# Altium schematic sheet Schematic_STM32.SchDoc
size A4; SheetNumber: 1; SheetTotal: 8
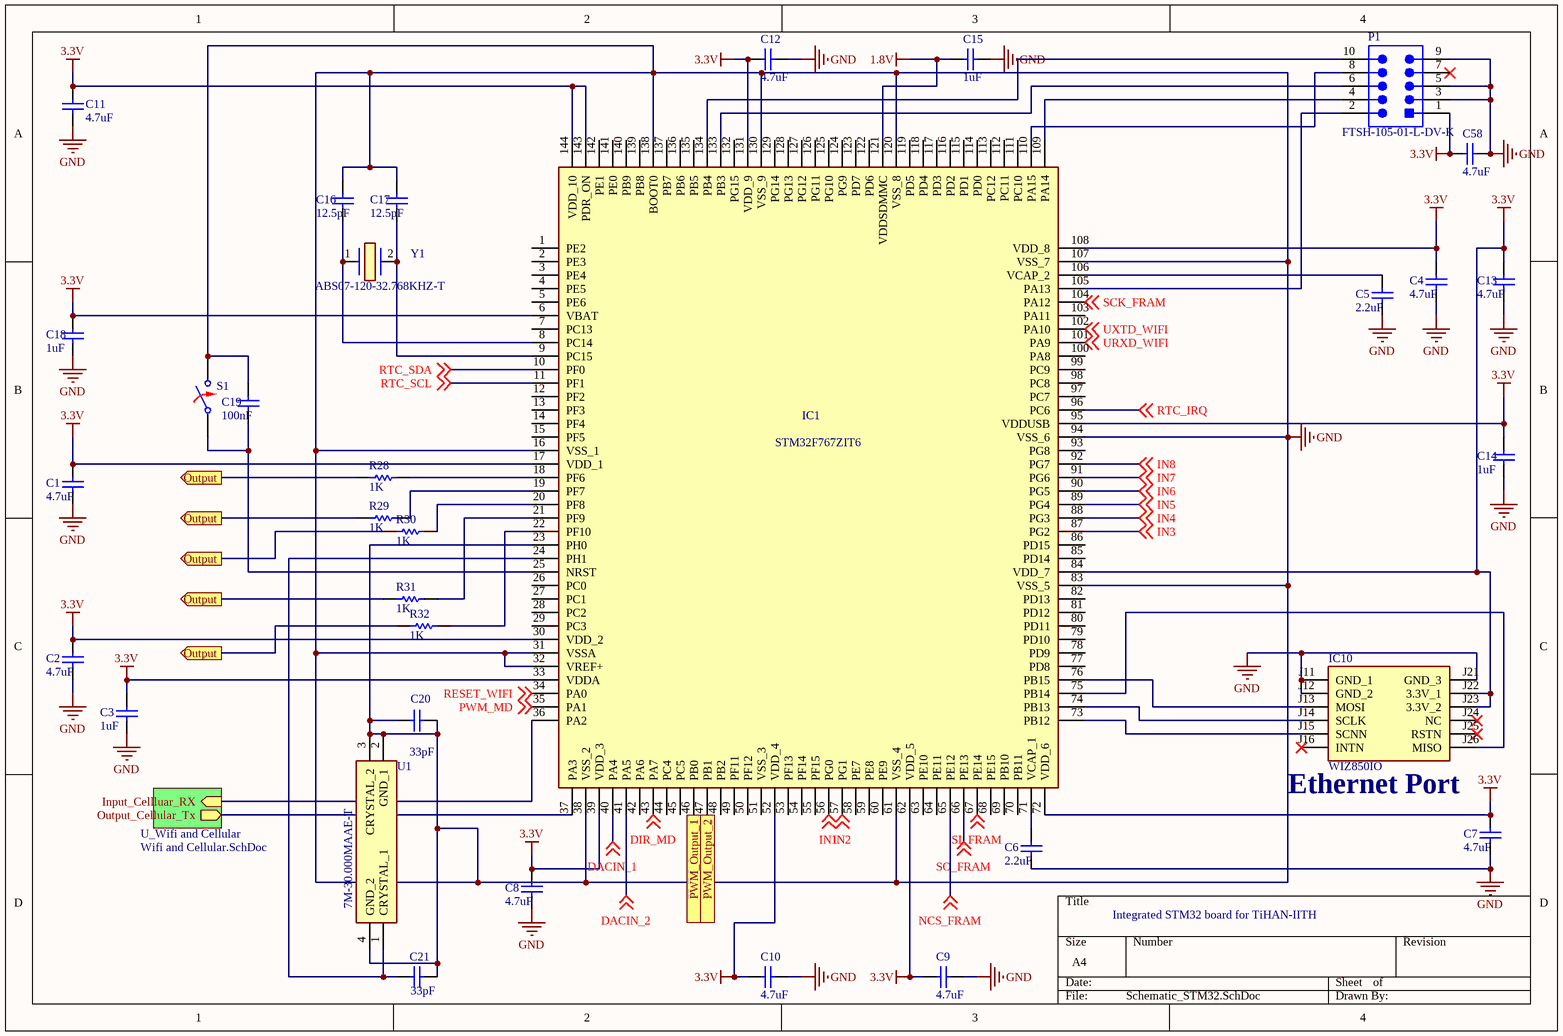
[diagram p0: Schematic_STM32.SchDoc]

## Parts
C1  value 4.7uF  [C1206]  (hidden comment: Cap)
C2  value 4.7uF  [C1206]  (hidden comment: Cap)
C3  value 1uF  [C1206]  (hidden comment: Cap)
C4  value 4.7uF  [C1206]  (hidden comment: Cap)
C5  value 2.2uF  [C1206]  (hidden comment: Cap)
C6  value 2.2uF  [C1206]  (hidden comment: Cap)
C7  value 4.7uF  [C1206]  (hidden comment: Cap)
C8  value 4.7uF  [C1206]  (hidden comment: Cap)
C9  value 4.7uF  [C1206]  (hidden comment: Cap)
C10  value 4.7uF  [C1206]  (hidden comment: Cap)
C11  value 4.7uF  [C1206]  (hidden comment: Cap)
C12  value 4.7uF  [C1206]  (hidden comment: Cap)
C13  value 4.7uF  [C1206]  (hidden comment: Cap)
C14  value 1uF  [C1206]  (hidden comment: Cap)
C15  value 1uF  [C1206]  (hidden comment: Cap)
C16  value 12.5pF  [C1206]  (hidden comment: Cap)
C17  value 12.5pF  [C1206]  (hidden comment: Cap)
C18  value 1uF  [C1206]  (hidden comment: Cap)
C19  value 100nF  [C1206]  (hidden comment: Cap)
C20  value 33pF  [RAD-0.3]  (hidden comment: Cap)
C21  value 33pF  [RAD-0.3]  (hidden comment: Cap)
C58  value 4.7uF  [C1206]  (hidden comment: Cap)
IC1  STM32F767ZIT6  [QFP50P2200X2200X160-144N]
IC10  WIZ850IO  [WIZ850IO]
P1  FTSH-105-01-L-DV-K  [SMTC-FTSH-105-01-L-DV-K_V]
R28  value 1K  (hidden comment: Resistor)
R29  value 1K  (hidden comment: Resistor)
R30  value 1K  (hidden comment: Resistor)
R31  value 1K  (hidden comment: Resistor)
R32  value 1K  (hidden comment: Resistor)
S1  Switch Normally Opened  (value not drawn)
U1  7M-30.000MAAE-T  [7M]
Y1  ABS07-120-32.768KHZ-T  [ABS07]

## Sub-sheets
U_Wifi and Cellular = Wifi and Cellular.SchDoc: Input_Cellluar_RX (in), Output_Cellular_Tx (out)

## Ports
Output (out), PWM_Output_1 (out), PWM_Output_2 (out)

## Nets
1.8V: C15.1 IC1.121(VDDSDMMC)
3.3V: C1.1 C2.1 C3.1 C4.1 C7.1 C8.1 C9.1 C10.1 C11.1 C12.1 C13.1 C14.1 C18.1 C58.1 IC1.6(VBAT) IC1.17(VDD_1) IC1.30(VDD_2) IC1.33(VDDA) IC1.39(VDD_3) IC1.52(VDD_4) IC1.62(VDD_5) IC1.72(VDD_6) IC1.84(VDD_7) IC1.95(VDDUSB) IC1.108(VDD_8) IC1.131(VDD_9) IC1.143(PDR_ON) IC1.144(VDD_10) IC10.J22(3.3V_1) IC10.J23(3.3V_2) P1.1
GND: C1.2 C2.2 C3.2 C4.2 C5.2 C6.2 C7.2 C8.2 C9.2 C10.2 C11.2 C12.2 C13.2 C14.2 C15.2 C16.1 C17.1 C18.2 C19.1 C20.1 C20.2 C21.2 C58.2 IC1.16(VSS_1) IC1.23(PH0) IC1.31(VSSA) IC1.32(VREF+) IC1.38(VSS_2) IC1.61(VSS_4) IC1.83(VSS_5) IC1.94(VSS_6) IC1.107(VSS_7) IC1.120(VSS_8) IC1.130(VSS_9) IC1.138(BOOT0) IC10.J11(GND_1) IC10.J12(GND_2) IC10.J21(GND_3) P1.3 P1.5 P1.9 S1.2 U1.2(GND_1) U1.3(CRYSTAL_2) U1.4(GND_2)
DACIN_1: IC1.40(PA4) ; off-sheet DACIN_1
DACIN_2: IC1.41(PA5) ; off-sheet DACIN_2
DIR_MD: IC1.43(PA7) ; off-sheet DIR_MD
IN1: IC1.56(PG0) ; off-sheet IN1
IN2: IC1.57(PG1) ; off-sheet IN2
IN3: IC1.87(PG2) ; off-sheet IN3
IN4: IC1.88(PG3) ; off-sheet IN4
IN5: IC1.89(PG4) ; off-sheet IN5
IN6: IC1.90(PG5) ; off-sheet IN6
IN7: IC1.91(PG6) ; off-sheet IN7
IN8: IC1.92(PG7) ; off-sheet IN8
NCS_FRAM: IC1.65(PE12) ; off-sheet NCS_FRAM
Output: R28.1 R29.1 R30.1 R31.1 R32.1 ; port Output
PWM_MD: IC1.35(PA1) ; off-sheet PWM_MD
PWM_Output_1: IC1.46(PB0) ; port PWM_Output_1
PWM_Output_2: IC1.47(PB1) ; port PWM_Output_2
RESET_WIFI: IC1.34(PA0) ; off-sheet RESET_WIFI
RTC_IRQ: IC1.96(PC6) ; off-sheet RTC_IRQ
RTC_SCL: IC1.11(PF1) ; off-sheet RTC_SCL
RTC_SDA: IC1.10(PF0) ; off-sheet RTC_SDA
SCK_FRAM: IC1.104(PA12) ; off-sheet SCK_FRAM
SI_FRAM: IC1.67(PE14) ; off-sheet SI_FRAM
SO_FRAM: IC1.66(PE13) ; off-sheet SO_FRAM
URXD_WIFI: IC1.101(PA9) ; off-sheet URXD_WIFI
UXTD_WIFI: IC1.102(PA10) ; off-sheet UXTD_WIFI
NetC5_1: C5.1 IC1.106(VCAP_2)
NetC6_1: C6.1 IC1.71(VCAP_1)
NetC16_2: C16.2 IC1.8(PC14) Y1.1
NetC17_2: C17.2 IC1.9(PC15) Y1.2
NetC19_2: C19.2 IC1.25(NRST) S1.1
NetC21_1: C21.1 IC1.24(PH1) U1.1(CRYSTAL_1)
NetIC1_18: IC1.18(PF6) R28.2
NetIC1_19: IC1.19(PF7) R29.2
NetIC1_20: IC1.20(PF8) R30.2
NetIC1_21: IC1.21(PF9) R31.2
NetIC1_22: IC1.22(PF10) R32.2
NetIC1_36: IC1.36(PA2) ; sheet U_Wifi and Cellular/Input_Cellluar_RX
NetIC1_37: IC1.37(PA3) ; sheet U_Wifi and Cellular/Output_Cellular_Tx
NetIC1_73: IC1.73(PB12) IC10.J15(SCNN)
NetIC1_74: IC1.74(PB13) IC10.J14(SCLK)
NetIC1_75: IC1.75(PB14) IC10.J26(MISO)
NetIC1_76: IC1.76(PB15) IC10.J13(MOSI)
NetIC1_105: IC1.105(PA13) P1.2
NetIC1_109: IC1.109(PA14) P1.4
NetIC1_110: IC1.110(PA15) P1.8
NetIC1_133: IC1.133(PB3) P1.6
NetIC1_134: IC1.134(PB4) P1.10

Not connected (* = marked no-connect by the designer): IC1 1(PE2) 2(PE3) 3(PE4) 4(PE5) 5(PE6) 7(PC13) 12(PF2) 13(PF3) 14(PF4) 15(PF5) 26(PC0) 27(PC1) 28(PC2) 29(PC3) 42(PA6) 44(PC4) 45(PC5) 48(PB2) 49(PF11) 50(PF12) 51(VSS_3) 53(PF13) 54(PF14) 55(PF15) 58(PE7) 59(PE8) 60(PE9) 63(PE10) 64(PE11) 68(PE15) 69(PB10) 70(PB11) 77(PD8) 78(PD9) 79(PD10) 80(PD11) 81(PD12) 82(PD13) 85(PD14) 86(PD15) 93(PG8) 97(PC7) 98(PC8) 99(PC9) 100(PA8) 103(PA11) 111(PC10) 112(PC11) 113(PC12) 114(PD0) 115(PD1) 116(PD2) 117(PD3) 118(PD4) 119(PD5) 122(PD6) 123(PD7) 124(PG9) 125(PG10) 126(PG11) 127(PG12) 128(PG13) 129(PG14) 132(PG15) 135(PB5) 136(PB6) 137(PB7) 139(PB8) 140(PB9) 141(PE0) 142(PE1); IC10 J16(INTN)* J24(NC)* J25(RSTN)*; P1 7*

## Notes on the sheet
- Ethernet Port
- Integrated STM32 board for TiHAN-IITH

## Library data of the parts
C1-C19 C58 = Cap Semi: Capacitor (Semiconductor SIM Model); Published: 8-Jun-2000; LatestRevisionDate: 29-May-2009; LatestRevisionNote: IPC-7351 Footprint Added.; PackageReference: C1206; Publisher: Altium Limited; PackageDescription: Chip Capacitor
C20 C21 = Cap: Capacitor; Published: 8-Jun-2000; LatestRevisionDate: 17-Jul-2002; LatestRevisionNote: Re-released for DXP Platform.; PackageReference: RAD-0.3; Publisher: Altium Limited; PackageDescription: Radial Cap, Thru-Hole; 2 Leads; 0.3 in Pin Spacing
IC1 = STM32F767ZIT6: Integrated Circuit; Manufacturer_Name: STMicroelectronics; Datasheet Link: http://www.farnell.com/datasheets/2034586.pdf; Height: 1.6mm; Manufacturer_Part_Number: STM32F767ZIT6; Mouser Part Number: 511-STM32F767ZIT6; Mouser Price/Stock: https://www.mouser.co.uk/ProductDetail/STMicroelectronics/STM32F767ZIT6?qs=dTJS0cRn7ojkBH6ijW6kKw%3D%3D; Arrow Part Number: STM32F767ZIT6; Arrow Price/Stock: https://www.arrow.com/en/products/stm32f767zit6/stmicroelectronics?region=nac
IC10 = WIZ850IO: Integrated Circuit; Manufacturer_Name: Wiznet Technology; Datasheet Link: https://docs.wiznet.io/Product/ioModule/wiz850io; Height: 18mm; Manufacturer_Part_Number: WIZ850IO; Mouser Part Number: 950-WIZ850IO; Arrow Part Number: WIZ850IO; Arrow Price/Stock: https://www.arrow.com/en/products/wiz850io/wiznet?region=nac
P1 = CMP-2000-05353-1: Male Header, Pitch 1.27 mm, 2 x 5 Position, Height 6.25 mm; Manufacturer: Samtec; Pitch: 0.050"(1.27mm); Other Names: Q3937619; Number of Positions: 10; Mating Products: SFMC-105-L2-S-D-TR-ND / -CONN.05"SURFACE10POSSMT / FLE-105-01-G-DV-TR-ND / -CONNSKT1.27MM10POSDUALSMD / FLE-105-01-G-DV-A-P-ND / -CONNSKT1.27MM10POSDUALSMD / FLE-105-01-G-DV-A-ND / -CONNSKT1.27MM10POSDUALSMD / CLP-105-02-G-D-P-TR-ND / -CONNRCPT10POSDUAL.05"SMD / SAM1155-05-ND / -CONNRCPT10POSDUAL.05"SMD / SAM1154-05-ND / -CONNRCPT10POSDUAL.05"SMD / SAM1153-05-ND / -CONNRCPT10POSDUAL.05"SMD / SAM1226-05-ND / -CONNRCPT.05"10POSDUALSMD; Number of Positions Loaded: All; Connector Type: Header,Unshrouded; Product Training Modules: Board-to-BoardConnectors; Datasheet Version: Rev. ET, 10/1995; Number of Rows: 2; Standard Package: 1; Package Description: Male Header, Pitch 1.27 mm, 2 x 5 Position, Height 5.97 mm, Tail Length 4.32 mm; Contact Finish Thickness: 10µin(0.25µm); Series: FTSH; Termination: Solder; Contact Type: MalePin; Color: Black; Package Reference: FTSH-105-01-L-DV-K; Family: RectangularConnectors-Headers,MalePins; Package URL: http://suddendocs.samtec.com/prints/ftsh-1xx-xx-xxx-dv-xxx-footprint.pdf; Packaging: Tube; Mounting Type: SurfaceMount; Category: Connectors,Interconnects; Datasheet URL: http://suddendocs.samtec.com/prints/ftsh-1xx-xx-xxx-dv-xxx-mkt.pdf; Row Spacing: 0.050"(1.27mm); Manufacturer URL: http://www.samtec.com/; Contact Mating Length: 0.120"(3.05mm); Contact Finish: Gold
R28-R32 = Resistor: TC1: 0; SimulationGenericComponent: True; TC2: 0
S1 = SW NO: closed: 0; Rclosed: 1m; Ropen: 1Meg; SimulationGenericComponent: True
U1 = 7M-30.000MAAE-T: Crystal or Oscillator; Manufacturer_Name: TXC; Datasheet Link: http://www.txccorp.com/download/products/quartz_crystals/2015TXC_7M_17.pdf; Manufacturer_Part_Number: 7M-30.000MAAE-T; Mouser Part Number: 717-7M-30.000MAAE-T; Mouser Price/Stock: https://www.mouser.com/Search/Refine.aspx?Keyword=717-7M-30.000MAAE-T
Y1 = ABS07-120-32.768KHZ-T: Crystal or Oscillator; Manufacturer_Name: ABRACON; Datasheet Link: https://abracon.com/Resonators/ABS07.pdf; Height: 0.9mm; Manufacturer_Part_Number: ABS07-120-32.768KHZ-T; Mouser Part Number: 815-ABS0712032.768KT; Mouser Price/Stock: https://www.mouser.co.uk/ProductDetail/ABRACON/ABS07-120-32.768KHZ-T?qs=z9S2%252BbP5pWhyNaQ4AovDCg%3D%3D; Arrow Part Number: ABS07-120-32.768KHZ-T; Arrow Price/Stock: https://www.arrow.com/en/products/abs07-120-32.768khz-t/abracon?region=nac